# EAGLE design SBWiFi (EAGLE 8.6.1)
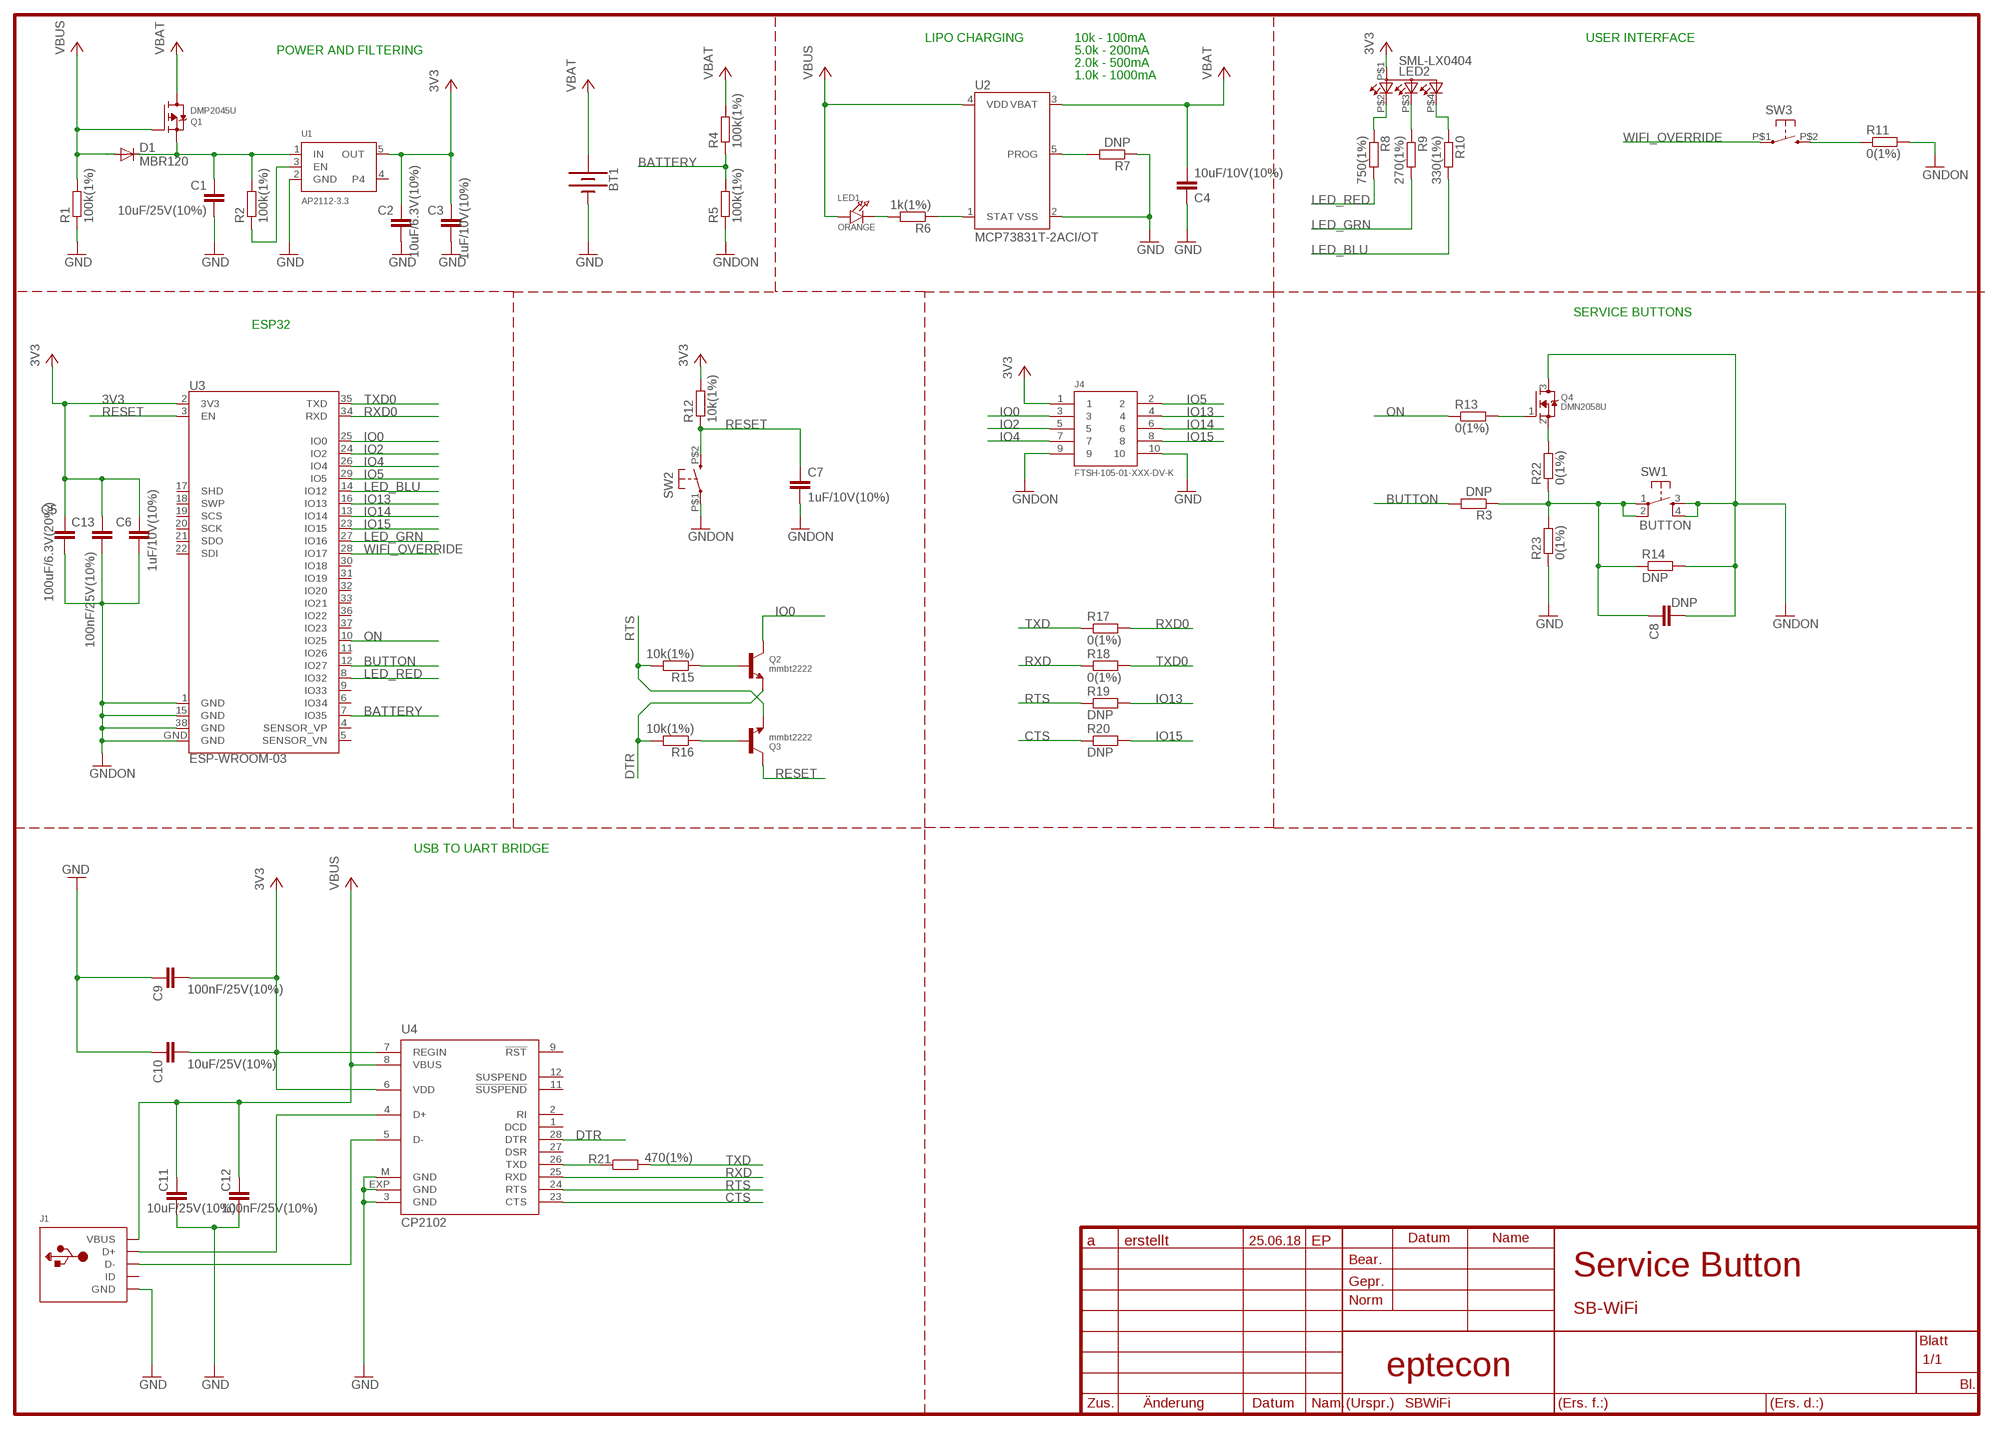
[diagram p0: schematic, sheet 1]

## Parts
BT1  BATTERY-AA  [BATTERY-AA]
C1  10uF/25V(10%)  C-EUC0603  [C0603]
C2  10uF/6.3V(10%)  C-EUC0603  [C0603]
C3  1uF/10V(10%)  C-EUC0603  [C0603]
C4  10uF/10V(10%)  C-EUC0603  [C0603]
C5  100uF/6.3V(20%)  C-EUC0805  [C0805]
C6  1uF/10V(10%)  C-EUC0603  [C0603]
C7  1uF/10V(10%)  C-EUC0603  [C0603]
C8  DNP  C-EUC0603  [C0603]
C9  100nF/25V(10%)  C-EUC0603  [C0603]
C10  10uF/25V(10%)  C-EUC0603  [C0603]
C11  10uF/25V(10%)  C-EUC0603  [C0603]
C12  100nF/25V(10%)  C-EUC0603  [C0603]
C13  100nF/25V(10%)  C-EUC0603  [C0603]
D1  MBR120  MBR0520LT  [SOD123]
J1  USBMINIBLARGE  [USB-MINIB_LARGER]
J4  FTSH-105-01-XXX-DV-K  [FTSH-105-01-XXX-DV-K]
LED1  ORANGE  LED0805_NOOUTLINE  [CHIPLED_0805_NOOUTLINE]
LED2  SML-LX0404  [LED_RGB]
Q1  DMP2045U  MOSFET-P  [SOT23-R]
Q2  mmbt2222  TRANSISTOR_NPN  [SOT23-R]
Q3  mmbt2222  TRANSISTOR_NPN  [SOT23-R]
Q4  DMN2058U  MOSFET-NREFLOW  [SOT23-R]
R1  100k(1%)  R-EU_R0603  [R0603]
R2  100k(1%)  R-EU_R0603  [R0603]
R3  DNP  R-EU_R0603  [R0603]
R4  100k(1%)  R-EU_R0603  [R0603]
R5  100k(1%)  R-EU_R0603  [R0603]
R6  1k(1%)  R-EU_R0603  [R0603]
R7  DNP  R-EU_R0603  [R0603]
R8  750(1%)  R-EU_R0603  [R0603]
R9  270(1%)  R-EU_R0603  [R0603]
R10  330(1%)  R-EU_R0603  [R0603]
R11  0(1%)  R-EU_R0603  [R0603]
R12  10k(1%)  R-EU_R0603  [R0603]
R13  0(1%)  R-EU_R0603  [R0603]
R14  DNP  R-EU_R0603  [R0603]
R15  10k(1%)  R-EU_R0603  [R0603]
R16  10k(1%)  R-EU_R0603  [R0603]
R17  0(1%)  R-EU_R0603  [R0603]
R18  0(1%)  R-EU_R0603  [R0603]
R19  DNP  R-EU_R0603  [R0603]
R20  DNP  R-EU_R0603  [R0603]
R21  470(1%)  R-EU_R0603  [R0603]
R22  0(1%)  R-EU_R0603  [R0603]
R23  0(1%)  R-EU_R0603  [R0603]
SW1  BUTTON  TACTILE-SWITCH-7914G  [7914G]
SW2  SKTDLDE010-T-SWITCH  [T-SWITCH-ALPS-2]
SW3  SKTDLDE010-T-SWITCH  [T-SWITCH-ALPS-2]
U1  AP2112-3.3  VREG_SOT23-5  [SOT23-5]
U2  MCP73831T-2ACI/OT  MCP73831  [SOT23-5]
U3  ESP-WROOM-03  [ESP-WROOM-03]
U4  CP2102  [MLP28]

## Nets
3V3: C2.1 C3.1 C5.1 C6.1 C9.2 C10.2 C13.1 J4.1 LED2.P$1(A2) R12.2 U1.5(OUT) U3.2(3V3) U4.6(VDD) U4.7(REGIN)
BATTERY: R4.1 R5.2 U3.7(IO35)
BUTTON: R3.2 U3.12(IO27)
CTS: R20.1 U4.23(CTS)
DTR: Q2.2(E) R16.2 U4.28(DTR)
GND: BT1.GND@1(-) C1.2 C2.2 C3.2 C4.1 C9.1 C10.1 C11.1 C12.1 J1.GND J4.9 J4.10 R1.1 R5.1 R7.1 R11.2 R23.1 U1.2(GND) U2.2(VSS) U4.3(GND) U4.EXP(GND) U4.M(GND) ; supply symbol labelled GNDON
GNDON: C5.2 C6.2 C7.2 C8.2 C13.2 Q4.3(D) R14.2 SW1.3 SW1.4 SW2.P$1 U3.1(GND) U3.15(GND) U3.38(GND) U3.GND
IO0: J4.3 Q2.3(C) U3.25(IO0)
IO2: J4.5 U3.24(IO2)
IO4: J4.7 U3.26(IO4)
IO5: J4.2 U3.29(IO5)
IO13: J4.4 R19.2 U3.16(IO13)
IO14: J4.6 U3.13(IO14)
IO15: J4.8 R20.2 U3.23(IO15)
LED_BLU: R10.2 U3.14(IO12)
LED_GRN: R9.2 U3.27(IO16)
LED_RED: R8.2 U3.8(IO32)
N$1: LED2.P$2(CRED) R8.1
N$2: LED2.P$3(CBLUE) R9.1
N$3: LED2.P$4(CGREEN) R10.1
N$4: C8.1 R3.1 R14.1 R22.1 R23.2 SW1.1 SW1.2
N$5: Q4.2(S) R22.2
N$6: Q4.1(G) R13.2
N$7: R2.1 U1.3(EN)
N$10: C1.1 D1.C Q1.2(S) R2.2 U1.1(IN)
N$24: Q3.1(B) R16.1
N$25: R21.1 U4.26(TXD)
N$26: Q2.1(B) R15.1
N$27: J1.D+ U4.4(D+)
N$28: J1.D- U4.5(D-)
N$31: R11.1 SW3.P$2
N$33: R6.1 U2.1(STAT)
N$34: LED1.C R6.2
N$37: R7.2 U2.5(PROG)
ON: R13.1 U3.10(IO25)
RESET: C7.1 Q3.3(C) R12.1 SW2.P$2 U3.3(EN)
RTS: Q3.2(E) R15.2 R19.1 U4.24(RTS)
RXD: R18.1 U4.25(RXD)
RXD0: R17.2 U3.34(RXD)
TXD: R17.1 R21.2
TXD0: R18.2 U3.35(TXD)
VBAT: BT1.PWR@1(+) C4.2 Q1.3(D) R4.2 U2.3(VBAT)
VBUS: C11.2 C12.2 D1.A J1.VBUS LED1.A Q1.1(G) R1.2 U2.4(VDD) U4.8(VBUS)
WIFI_OVERRIDE: SW3.P$1 U3.28(IO17)
Unconnected: J1.ID U1.4 U3.4(SENSOR_VP) U3.5(SENSOR_VN) U3.6(IO34) U3.9(IO33) U3.11(IO26) U3.17(SHD) U3.18(SWP) U3.19(SCS) U3.20(SCK) U3.21(SDO) U3.22(SDI) U3.30(IO18) U3.31(IO19) U3.32(IO20) U3.33(IO21) U3.36(IO22) U3.37(IO23) U4.1(DCD) U4.2(RI) U4.9(!RST) U4.11(!SUSPEND) U4.12(SUSPEND) U4.27(DSR)

## Notes on the sheet
- LIPO CHARGING | 10k - 100mA | USER INTERFACE
- POWER AND FILTERING | 5.0k - 200mA
- 2.0k - 500mA
- 1.0k - 1000mA
- SERVICE BUTTONS
- ESP32
- USB TO UART BRIDGE
- a | erstellt | 25.06.18 | EP
- Service Button
- SB-WiFi
- eptecon

## Library data of the parts
BT1 = SparkFun-Batteries:BATTERY: Battery - Single Cell A variety of battery chemistries, sizes, and footprints. Device List: 20MM_PTH - Coin Cell Battery Holder - 20mm (PTH) <https://www.sparkfun.com/products/783> 6.8MM_PTH - Coin Cell Battery Holder - 6.8MM(SMD) <https://www.digikey.com/product-detail/en/seiko-instruments/MS621FE-FL11E/728-1057-ND/1889208?WT.srch=1&gclid=CNOQ5a6LzdQCFZS2wAodXCkE0g> 12MM_SMD - Coin Cell Battery Holder - 12mm (SMD) <https://www.sparkfun.com/products/10592> 12MM_PTH - Coin Cell Battery Holder - 12mm (PTH) <https://www.sparkfun.com/products/7948> 20MM_SMD - 20mm Coin Cell Battery Holder (SMD) (2 legs) Used on the Big Time Watch Kit <https://www.sparkfun.com/products/11734> 20MM_SMD_4LEGS - Coin Cell Battery Holder - 20mm (SMD) <https://www.sparkfun.com/products/11892> 20MM_SMD_4LEGS_OVERPASTE - Coin Cell Battery Holder - 20mm (SMD) <https://www.sparkfun.com/products/11892> (Over-paste on the legs) 24.5MM_PTH - Coin Cell Battery Holder - 24.5mm (PTH) <https://www.sparkfun.com/products/8863> 9V - 9V Battery Holder - PC Mount Used on the SparkFun SparkPunk Sound Kit <https://www.sparkfun.com/products/11177> and SparkFun SparkPunk Sequencer Kit <https://www.sparkfun.com/products/12707> 18650 - Battery Holder - 18650 (PTH) <https://www.sparkfun.com/products/13113> AA - Battery Holder - 1xAA (PTH) <https://www.sparkfun.com/products/7949> AAA - Battery Holder - 1xAAA (PTH) <https://www.sparkfun.com/products/12718> AA_KIT - Battery Holder - 1xAA (PTH) <https://www.sparkfun.com/products/7949> Special kit package - pads only have exposed copper on one side of the board. AAA_KIT - Battery Holder - 1xAAA (PTH) <https://www.sparkfun.com/products/12718> Special kit package - pads only have exposed copper on one side of the board.; PROD_ID: BATT-08316; SF_SKU: PRT-07949
C1-C13 = rcl:C-EU: CAPACITOR, European symbol
D1 = diode:MBR0520LT: SCHOTTKY BARRIER RECTIFIER Source: http://onsemi.com .. MBR0520LT1-D.pdf
J1 = microbuilder:USB: USB Connectors USBMINIB - Surface Mount Female Mini-B USB Connector 4UConnector: 06564
J4 = FTSH-105-01-XXX-DV-K:FTSH-105-01-XXX-DV-K: 0.05"x0.05" DOUBLE ROW SMT STRIP ASSEMBLY. MANUFACTURER:SAMTEC.
LED1 = microbuilder:LED: LED 0603 - 0603 Surface Mount Package 2mA: Green LED - Low Power (3.9mcd, 2ma, 1.7Vf) - Digikey: 475-2709-2-ND Orange LED - Low Power (9.8mcd, 2ma, 1.8Vf) - Digikey: 475-1194-2-ND Red LED - Low Power (5mcd, 2ma, 1.8Vf) - Digikey: 475-1195-2-ND Yellow LED - Low Power (7mcd, 2ma, 1.8Vf) - Digikey: 475-1196-2-ND 5mA: Blue LED - Low Power (17mcd, 5ma, 2.9Vf) - Digikey: LNJ937W8CRACT-ND 0805 - 0805 Surface Mount Package 2mA: Red LED (8.8mcd, 2mA, 1.8Vf, Clear) - Low Power [Digikey: 475-2510-1-ND] Green LED (5mcd, 2mA, 1.8Vf, Clear) - Low Power [Digikey: 475-2730-1-ND] Yellow LED (11.3mcd, 2mA, 1.8Vf, Clear) - Low Power [Digikey: 475-2555-1-ND] 20mA: Red LED (104mcd, 20mA, Diffused) - LS R976 [Digikey: 475-1278-6-ND] Red LED (12mcd, 20mA, 2.0Vf, Clear) - APT2012EC [Digikey: 754-1128-1-ND] Green LED (15mcd, 20mA, 2.2Vf, Clear) - APT2012GC [Digikey: 754-1131-1-ND] Orange LED (160mcd, 20mA, 2.1Vf, Clear) - APT2012SECK [Digikey: 754-1130-1-ND] 1206 - 1206 Surface Mount Package Green LED (26mcd, 20mA, Diffused) - LG N971 [Digikey: 475-1407-6-ND] Red LED (15mcd, 20mA, Diffused) - LH N974 [Digikey: 475-1416-6-ND]
LED2 = led:SML-LX0404
Q1 = microbuilder:MOSFET-P: P-Channel Mosfet LEGEND VDS: Voltage Drain-Source ID: Drain Current RDS(ON): Drain-Source On-State Resistance VGS(TH): Gate-Source Threshold Voltage CISS: Drain-Source Input Capacitance SOT-23 Name VDS ID RDS(ON) VGS(TH) CISS Order Number IRLML5103 30V 760mA 600 mOhm -- 75pF @ 25V Digikey: IRLML5103PBFCT-ND IRLML6401 12V 4.3A 50 mOhm 950mV @ 250µA 830pF @ 10V Digikey: IRLML6401PBFTR-ND NTR0202PL 20V 400mA 800 mOhm 2.3V @ 250uA 70pF @ 5V Digikey: NTR0202PLT1GOSTR-ND NTR4101PT1G 20V 1.8A 85 mOhm 1.2V @ 250uA 675pF @ 10V Digikey: NTR4101PT1GOSCT-ND DMP2004K 20V 600mA 900 mOhm 1V @ 250uA 175pF @ 16V Digikey: DMP2004KDICT-ND PMV65XP 20V 3.9A 76 mOhm 950mV @ 1mA 725pF @ 20V Digikey: 568-2358-2-ND TO-252 Name VDS ID RDS(ON) VGS(TH) CISS Order Number AOD417 30V 25A 34 mOhm 3V @ 250µA 920pF @ 15V Digikey: 785-1106-2-ND
Q2 Q3 = microbuilder:TRANSISTOR_NPN: NPN Transistor Transistor (NPN) 500mA 45V - BC817 [Digikey: 568-1631-1-ND] Transistor (NPN) 500mA 45V - BC817,215 [Mouser: 771-BC817-T/R] SOT23-R - SOT23 footprint optimised for use with solder paste and reflow ovens. SOT23-W - SOT23 footprint optimised for hand-soldering (larger pads).
Q4 = microbuilder:MOSFET-N: N-Channel Mosfet LEGEND VDS: Voltage Drain-Source ID: Drain Current RDS(ON): Drain-Source On-State Resistance VGS(TH): Gate-Source Threshold Voltage CISS: Drain-Source Input Capacitance SOT-23 Name VDS ID RDS(ON) VGS(TH) CISS Order Number 2N7002E 60V 260mA 2.5 Ohm 2.5V @ 250uA 26.7pF @ 25V 2N7002ET1GOSTR-ND BSH103 30V 850mA 400 mOhm 400mV @ 1mA 83pF @ 24V BSH103,235-ND BSS138 60V 320mA 1.6 Ohm 1.5V @ 250uA 50pF @ 10V Mouser: 771-BSS138PW115 DMN2075U-7 20V 4.2A 38 mOhm 1V @ 250 uA 594.3pF @ 10V DMN2075U-7DICT-ND * BSS138 good choice for I2C level-shifting
R1-R23 = rcl:R-EU_: RESISTOR, European symbol
SW1 = GeekAmmo:TACTILE-SWITCH: Tactile Switch 4 Pins, SPST NO
SW2 SW3 = GeekAmmo:SKTDLDE010-T-SWITCH
U1 = microbuilder:VREG_SOT23-5: SOT23-5 Fixed Voltage Regulators To better organise some of the SOT23-5 fixed voltage regulators in this library, this new part was created. Part Current Out V Out V In V Dropout Digikey Part No. ADP121 150mA 3.3V 3.4-5.5V 0.09V @ 150mA ADP121-AUJZ33R7CT-ND ADP121 150mA 3.0V 3.1-5.5V 0.09V @ 150mA ADP121-AUJZ30R7CT-ND ADP122 300mA 3.3V 3.4-5.5V 0.085V @ 300mA ADP122AUJZ-3.3-R7CT-ND ADP1712 300mA 3.3V 3.5-5.5V 0.17V @ 300mA ADP1712AUJZ-3.3-R7TR-ND AP7311 (Low Cost) 150mA 3.3V 3.5-6V 0.15V @ 150mA AP7311-33WG-7DICT-ND LD39015M18R 150mA 1.8V 1.9V-5.5V 0.08V @ 100mA 497-6977-1-ND MCP1824T-3302E/OT 300mA 3.3V 3.5V-6V 0.2V @ 300mA MCP1824T-3302E/OTCT-ND MIC5205-2.5YM5 TR 150mA 2.5V 2.7-16V 0.165V @ 150mA 576-1257-2-ND MIC5205-3.0YM5 TR 150mA 3.0V 3.2V-16V 0.165V @ 150mA 576-1258-2-ND MIC5205-3.3YM5 TR 150mA 3.3V 3.5V-16V 0.165V @ 150mA 576-1259-2-ND TPS780330220 150mA 3.3V+2.2V 3.6-5.5V 250mV Max 296-23332-1-ND TDA3663/N1,135 100mA 3.3V 3.5-45V 0.18V @ 50mA 568-5343-1-ND
U2 = GeekAmmo:MCP73831: MCP73831 Miniature Single-Cell, Fully Integrated Li-Ion, Li-Polymer Charge Management Controllers The MCP73831/2 devices are highly advanced linear charge management controllers for use in spacelimited, cost-sensitive applications. http://ww1.microchip.com/downloads/en/DeviceDoc/20001984F.pdf
U3 = esp32-thing-temp:ESP-WROOM-03
U4 = silabs:CP210*: Single-Chip USB to UART Bridge Source: www.silabs.com .. CP2101.pdf / cp2102.pdf; MF: FARNELL; MPN: CP2102-GM; OC_FARNELL: 9282130; OC_NEWARK: 30K5635

## Board
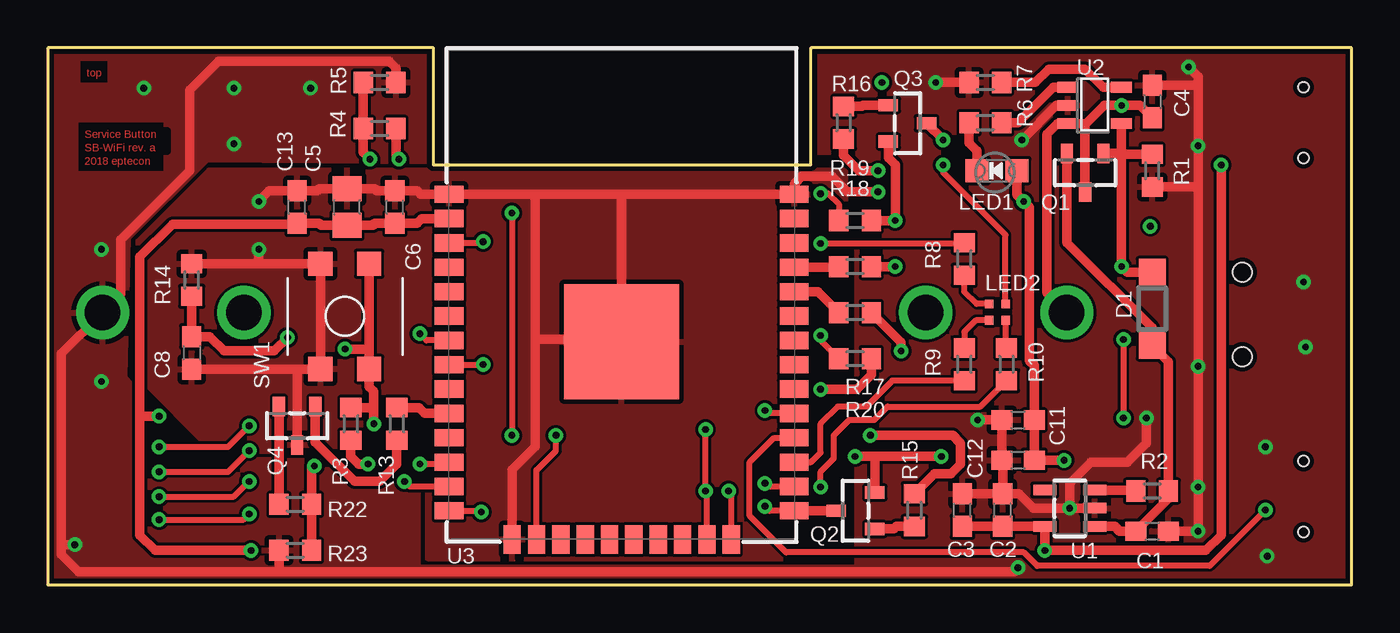
[diagram p1: board, top side]
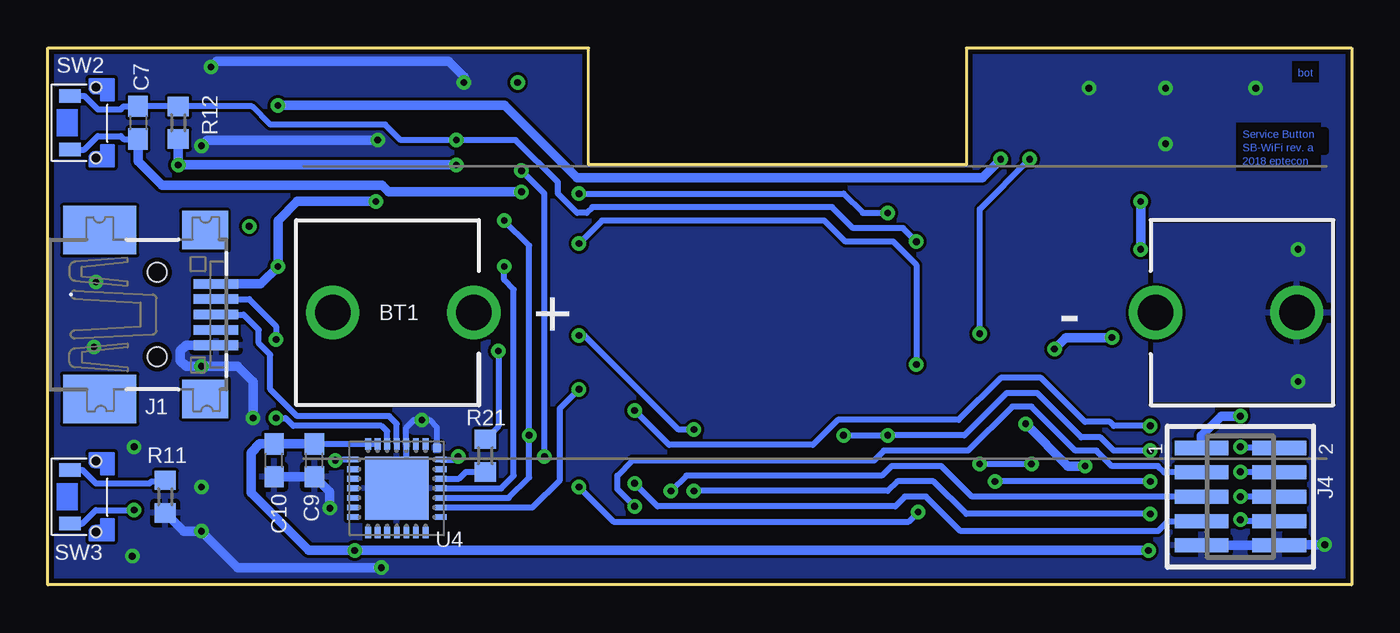
[diagram p2: board, bottom side, seen from below]

Size 68 x 28 mm. Coordinates in mm from the lower left corner, seen from the top.
Outline: 0,0 68,0 68,28 39.8,28 39.8,21.9 20.1,21.9 20.1,28 0,28 0,0
Copper layers (1*16): Top 0.035mm / dielectric 1.5mm / Bottom 0.035mm
Design rules "default *": minimum track width 10mil, minimum drill 10mil, track to track 6mil, track to pad 6mil, pad to pad 6mil, via to via 6mil, smd to smd 6mil, copper to edge 10mil, drill to drill 8mil, minimum pad ring 10mil, minimum via ring 8mil, stop-mask expansion 4mil, vias tented up to drill 0mil, thermal gap 10mil
tRestrict: area 1.7,26.2 to 3.1,27.3; area 1.6,21.6 to 6,24.1
bRestrict: area 1.7,26.2 to 3.1,27.3; area 1.6,21.6 to 6,24.1

### Footprints (pad centres in the part's own frame; a part is rotated, then mirrored left to right if it is on the bottom)
BATTERY-AA = drill 1.854: GND@1 25.146,0; GND@2 17.78,0; PWR@1 -25.146,0; PWR@2 -17.78,0
C0603 = smd 1.1 x 1: 1 -0.85,0; 2 0.85,0
C0805 = smd 1.3 x 1.5: 1 -0.95,0; 2 0.95,0
SOD123 = smd 1.4 x 1.4: A 1.9,0; C -1.9,0
USB-MINIB_LARGER = smd 0.5 x 2.308: D+ 0,4.064; D- -0.8,4.064; GND 1.6,4.064; ID 0.8,4.064; VBUS -1.6,4.064 | smd 2.54 x 3.81: GND1 -4.4,-2; GND4 4.4,-2 | smd 2 x 2.4: GND2 -4.4,3.5; GND3 4.4,3.5 | hole 1: -2.2,1; 2.2,1
FTSH-105-01-XXX-DV-K = smd 0.737 x 2.794: 1 -2.54,-2.032; 2 -2.54,2.032; 3 -1.27,-2.032; 4 -1.27,2.032; 5 0,-2.032; 6 0,2.032; 7 1.27,-2.032; 8 1.27,2.032; 9 2.54,-2.032; 10 2.54,2.032
CHIPLED_0805_NOOUTLINE = smd 1.2 x 1.2: A 0,-1.05; C 0,1.05
LED_RGB = smd 0.45 x 0.45: P$1 -0.45,-0.45; P$2 0.4,-0.45; P$3 0.4,0.4; P$4 -0.45,0.4
SOT23-R = smd 0.635 x 1.016: 1 -0.95,-1; 2 0.95,-1; 3 0,1
R0603 = smd 1 x 1.1: 1 -0.85,0; 2 0.85,0
7914G = smd 1.27 x 1.27: 1 -1.254,-2.746; 2 -1.254,2.74; 3 1.286,-2.746; 4 1.286,2.74
T-SWITCH-ALPS-2 = smd 0.7 x 1.1: P$1 -1.4,1.35; P$2 1.4,1.35 | hole 0.55: -1.85,0; 1.85,0
SOT23-5 = smd 0.55 x 1.2: 1 -0.95,-1.3; 2 0,-1.3; 3 0.95,-1.3; 4 0.95,1.3; 5 -0.95,1.3
SOT23-5' = smd 0.55 x 1.1: 1 -0.95,-1.3; 2 0,-1.3; 3 0.95,-1.3; 4 0.95,1.5; 5 -0.95,1.5
ESP-WROOM-03 = smd 0.9 x 1.5: 1 7.7,9; 2 6.43,9; 3 5.16,9; 4 3.89,9; 5 2.62,9; 6 1.35,9; 7 0.08,9; 8 -1.19,9; 9 -2.46,9; 10 -3.73,9; 11 -5,9; 12 -6.27,9; 13 -7.54,9; 14 -8.81,9; 25 -8.81,-9; 26 -7.54,-9; 27 -6.27,-9; 28 -5,-9; 29 -3.73,-9; 30 -2.46,-9; 31 -1.19,-9; 32 0.08,-9; 33 1.35,-9; 34 2.62,-9; 35 3.89,-9; 36 5.16,-9; 37 6.43,-9; 38 7.7,-9 | smd 1.5 x 0.9: 15 -10.3,5.715; 16 -10.3,4.445; 17 -10.3,3.175; 18 -10.3,1.905; 19 -10.3,0.635; 20 -10.3,-0.635; 21 -10.3,-1.905; 22 -10.3,-3.175; 23 -10.3,-4.445; 24 -10.3,-5.715 | smd 6 x 6: GND 0,0
MLP28 = smd 0.6 x 0.3: 1 -2.3,1.5; 2 -2.3,1; 3 -2.3,0.5; 4 -2.3,0; 5 -2.3,-0.5; 6 -2.3,-1; 7 -2.3,-1.5; 15 2.3,-1.5; 16 2.3,-1; 17 2.3,-0.5; 18 2.3,0; 19 2.3,0.5; 20 2.3,1; 21 2.3,1.5 | smd 0.3 x 0.6: 8 -1.5,-2.3; 9 -1,-2.3; 10 -0.5,-2.3; 11 0,-2.3; 12 0.5,-2.3; 13 1,-2.3; 14 1.5,-2.3; 22 1.5,2.3; 23 1,2.3; 24 0.5,2.3; 25 0,2.3; 26 -0.5,2.3; 27 -1,2.3; 28 -1.5,2.3 | smd 3.3 x 3.3: EXP 0,0 | smd 0.435 x 0.435: M -2.103,2.103

### Placement (x,y rotation side)
BT1  28,14.2 0 bottom
C1  57.6,2.8 0 top
C2  49.8,3.9 90 top
C3  47.7,3.9 90 top
C4  57.6,25.2 270 top
C5  15.6,19.7 90 top
C6  18.1,19.7 90 top
C7  63.3,24.1 270 bottom
C8  7.5,12.1 270 top
C9  54.1,6.5 90 bottom
C10  56.2,6.5 90 bottom
C11  50.6,8.6 0 top
C12  50.6,6.5 0 top
C13  13,19.7 90 top
D1  57.6,14.4 90 top
J1  63.3,14.1 270 bottom
J4  5.8,4.6 270 bottom
LED1  49.5,21.6 90 top
LED2  49.5,14.2 180 top
Q1  54.1,21.5 180 top
Q2  42.13,3.87 90 top
Q3  44.84,24.07 270 top
Q4  13,8.3 180 top
R1  57.6,21.6 90 top
R2  57.6,4.9 0 top
R3  15.8,8.4 270 top
R4  17.3,23.8 0 top
R5  17.3,26.2 180 top
R6  48.9,24.1 180 top
R7  48.9,26.2 0 top
R8  47.8,17 90 top
R9  47.8,11.5 270 top
R10  50,11.5 270 top
R11  61.88,4.6 270 bottom
R12  61.2,24.1 270 bottom
R13  18.2,8.4 270 top
R14  7.5,15.9 90 top
R15  45.2,3.9 90 top
R16  41.5,24.1 270 top
R17  42.1,14.2 180 top
R18  42.1,16.6 180 top
R19  42.1,19 180 top
R20  42.1,11.8 180 top
R21  45.19,6.74 90 bottom
R22  12.9,4.2 180 top
R23  12.9,1.8 0 top
SW1  15.5,14 180 top
SW2  65.5,24.1 90 bottom
SW3  65.5,4.6 90 bottom
U1  53.3,4 90 top
U2  MCP73831T-2ACI/OT  [SOT23-5']  54.5,25 270 top
U3  29.93,12.67 90 top
U4  49.8,5.04 270 bottom

### Tracks (layer width: path | path; a pad name or v marks a point on that pad's centre or on a via)
3V3  (via drill 0.35)
  Top 0.3: LED2.P$1 49.95,18.25 46.7,21.5 v46.7,21.9
  Top 0.5: U3.2 19.5,19.1 19.25,18.85 C6.1 17.05,18.85 16.95,18.75 C5.1 14.25,18.75 14.15,18.85 C13.1 12.95,18.8 6.5,18.8 4.8,17.1 4.8,8.8 | v52,1.8 U1.5 C2.1 C3.1 | v52,1.8 | v10.6,1.8 5.6,1.8 4.8,2.6 4.8,8.8 | v52,1.8 60.4,1.8 61.2,2.6 v61.2,21.9 | v5.8,8.8 4.8,8.8
  Bottom 0.3: U4.6 U4.7 54.09,7.34 C9.2
  Bottom 0.5: v46.7,21.9 v61.2,21.9 R12.2 | v10.6,1.8 v52,1.8 54.4,1.8 57.4,4.8 57.4,6.9 56.95,7.35 C10.2 C9.2 | J4.1 7.83,7.77 6.8,8.8 v5.8,8.8
BATTERY  (via drill 0.35)
  Top 0.3: U3.7 19.75,12.75 v19.4,13.1
  Top 0.5: R5.2 R4.1 16.45,22.55 v16.8,22.2
  Bottom 0.3: v16.8,22.2 19.4,19.6 v19.4,13.1
BUTTON  (via drill 0.35)
  Top 0.3: 20.83,6.3 v19.4,6.3
  Top 0.5: U3.12 20.83,6.3 | v16.7,6.3 16.2,6.3 15.8,6.7 R3.2
  Bottom 0.3: v16.7,6.3 v19.4,6.3
CTS  (via drill 0.35)
  Top 0.5: R20.1 42.95,10.95 42.2,10.2 v40.3,10.2
  Bottom 0.3: U4.23 42.73,4.04 41.3,5.47 41.3,9.2 v40.3,10.2
DTR  (via drill 0.35)
  Top 0.5: v46.6,6.7 43.1,6.7 | 43.1,6.7 v42.1,6.7 | Q2.2 43.13,6.67 43.1,6.7 | R16.2 41.5,22.4 42.3,21.6 v43.3,21.6
  Bottom 0.3: U4.28 46.76,6.54 v46.6,6.7 | v43.3,21.6 42.1,20.4 v42.1,6.7
GND  (via drill 0.35)
  Top 0.5: U2.2 52.6,25 v50.8,23.2 | 0.7,2.1 0.7,1.6 1.6,0.7 12.1,0.7 | 0.7,2.1 0.7,12.05 BT1.GND@1 3.8,15.15 3.8,18 7.4,21.6 7.4,25.8 8.9,27.3 17.8,27.3 18.15,26.95 R5.1 | v1.4,2.1 0.7,2.1 | 60,20.8 v60,11.4 v60,5.1 v60,2.8 C1.2 | 60,20.8 v60,22.9 60,26.1 | R1.1 59.95,20.75 60,20.8 | 60,26.1 60,26.5 v59.5,27 | C4.1 59.95,26.05 60,26.1 | v50.6,0.9 50.4,0.7 12.1,0.7 | R23.1 12.05,0.75 12.1,0.7 | C3.2 C2.2 | C2.2 49.8,6.45 C12.1 C11.1 v48.5,8.6 | C2.2 50.65,4.75 51.4,4 v53.3,4 | v53.3,4 U1.2 | v53.3,4 53.3,5.3 54.4,6.4 56.3,6.4 57.3,7.4 v57.3,8.7 | R7.1 v46.3,26.2
  Bottom 0.3: U4.EXP 49.3,5.54 U4.3 49.3,8.2 48.9,8.6 v48.5,8.6 48.1,8.6 47.7,8.2 U4.M
  Bottom 0.5: J4.9 J4.10 3.73,2.1 v1.4,2.1 | v59.5,27 59.2,27.3 47.1,27.3 46.3,26.5 v46.3,26.2 | v53.3,4 53.3,4.85 C9.1 C10.1 | v50.8,23.2 59.7,23.2 v60,22.9 | R11.2 60.92,2.8 v60,2.8 58.1,0.9 v50.6,0.9 | J1.GND 60.8,12.5 61.1,12.2 61.1,11.7 60.8,11.4 v60,11.4 58.1,11.4 57.3,10.6 v57.3,8.7
  other vias: 2.8,10.6 2.8,17.5 5,25.9 9.7,25.9 13.7,25.9 9.7,23 63.6,1.5 63.5,7.2 65.5,15.8 65.6,12.4
  pour Top: 19.8,22.1 19.8,27.7 0.3,27.7 0.3,0.3 67.7,0.3 67.7,27.7 40.1,27.7 40.1,22.6 42.2,22.6 42.2,0.9 19.3,0.9 19.3,6.5 8,6.5 4,10.8 4.2,18.1 8.3,22.2
  pour Bottom: 0.3,27.7 19.8,27.7 19.8,21.7 19.8,21.6 40.1,21.6 40.1,27.7 67.7,27.7 67.7,0.3 0.3,0.3
GNDON  (via drill 0.35)
  Top 0.5: 13.05,7.35 Q4.3 13,11.25 | 24.2,20.37 U3.1 19.43,20.37 19.25,20.55 C6.2 17.15,20.55 17.05,20.65 C5.2 14.15,20.65 14.05,20.55 C13.2 11.55,20.55 v11,20 | 24.2,20.37 25.4,20.37 | 25.4,20.37 30,20.37 | 30,20.37 U3.38 38.93,20.93 39.3,21.3 40.9,21.3 41.7,20.5 v43.3,20.5 | 30,20.37 29.93,20.3 U3.GND 29.8,12.8 25.4,12.8 | 24.21,20.36 24.2,20.37 | U3.15 24.21,6.01 25.4,7.2 25.4,12.8 | 25.4,12.8 25.4,20.37 | 10.9,16.75 11,16.85 v11,17.5 | 10.9,16.75 SW1.3 SW1.4 13,11.25 | 10.9,16.75 R14.2 | C8.2 13,11.25
  Bottom 0.3: SW2.P$1 66.1,22.7 65.4,23.4 64.2,23.4 64.05,23.25 C7.2
  Bottom 0.5: v43.3,20.5 50.22,20.5 50.56,20.83 62.03,20.83 63.3,22.1 C7.2 | v11,17.5 v11,20
  pour Top: 20.1,21.6 8.4,21.6 4.7,17.9 4.7,10.9 8.6,7 19.8,7 19.8,1.4 41.6,1.4 41.6,21.6
IO0  (via drill 0.35)
  Top 0.3: U3.25 37.64,3.86 v37.4,4.1
  Top 0.5: Q2.3 U3.25
  Bottom 0.3: J4.3 9.77,5.87 10.1,6.2 12.5,6.2 13.3,7 14.4,7 16.7,9.3 17.7,9.3 20,7 24.4,7 24.9,6.5 37.5,6.5 38.3,5.7 38.3,5 v37.4,4.1
IO2  (via drill 0.35)
  Top 0.3: U3.24 35.64,4.76 v35.5,4.9
  Bottom 0.3: J4.5 19.8,4.6 21.4,6.2 24,6.2 24.5,5.7 34.7,5.7 v35.5,4.9
IO4  (via drill 0.35)
  Top 0.3: U3.26 37.57,5.13 v37.4,5.3
  Bottom 0.3: J4.7 7.86,3.3 9.6,3.3 10.1,2.8 20.4,2.8 22.2,4.6 23.3,4.6 23.8,4.1 36.2,4.1 v37.4,5.3
IO5  (via drill 0.35)
  Top 0.3: U3.29 37.56,8.94 v37.4,9.1 | v5.8,7.2 9.4,7.2 v10.5,8.3
  Bottom 0.3: J4.2 5.74,7.14 v5.8,7.2 | v10.5,8.3 12.4,8.3 12.6,8.5 13.9,8.5 16.2,10.8 18.3,10.8 20.5,8.6 26.8,8.6 28.1,7.3 35.6,7.3 v37.4,9.1
IO13  (via drill 0.35)
  Top 0.3: v40.3,20.4 40.7,20.4 41.25,19.85 R19.2 | v10.5,7 9.4,5.9 v5.8,5.9 | v24.2,19.4 v24.2,7.8 | U3.16 25.48,5.98 26.5,7 v26.5,7.8
  Bottom 0.3: J4.4 5.77,5.87 v5.8,5.9 | v40.3,20.4 26.5,20.4 25.5,19.4 v24.2,19.4 | v10.5,7 12.4,7 13.1,7.7 14.1,7.7 16.4,10 18,10 20.2,7.8 v24.2,7.8 v26.5,7.8
IO14  (via drill 0.35)
  Top 0.3: v5.8,4.6 9.7,4.6 v10.5,5.4 | U3.13 18.87,5.13 v18.6,5.4
  Bottom 0.3: J4.6 v5.8,4.6 | v10.5,5.4 v18.6,5.4
IO15  (via drill 0.35)
  Top 0.3: R20.2 40.3,12.75 v40.3,13 | v5.8,3.4 10.2,3.4 v10.5,3.7 | U3.23 34.37,4.83 v34.3,4.9 v34.3,8.1
  Bottom 0.3: J4.8 5.73,3.33 v5.8,3.4 | v10.5,3.7 20.1,3.7 21.8,5.4 23.7,5.4 24.2,4.9 v34.3,4.9 | v40.3,13 40,13 35.1,8.1 v34.3,8.1
LED_BLU  (via drill 0.35)
  Top 0.3: v40.3,5.1 40.3,5.9 41,6.6 41,7.8 41.8,8.6 43.1,8.6 43.8,9.3 48.65,9.3 R10.2 | U3.14 22.54,3.86 v22.6,3.8
  Bottom 0.3: v40.3,5.1 38.5,3.3 23.1,3.3 v22.6,3.8
LED_GRN
  Top 0.3: U3.27 39.8,6.4 40.3,6.9 40.3,8.4 41.2,9.3 42.7,9.3 44.05,10.65 R9.2
LED_RED  (via drill 0.35)
  Top 0.3: U3.8 22.68,11.48 v22.7,11.5 | R8.2 47.75,17.8 v40.3,17.8
  Bottom 0.3: v22.7,11.5 22.7,16.7 23.9,17.9 26.4,17.9 27.5,19 39.1,19 v40.3,17.8
N$1
  Top 0.3: LED2.P$2 48.45,14.65 47.8,15.3 R8.1
N$2
  Top 0.3: LED2.P$3 48.4,13.8 47.8,13.2 R9.1
N$3
  Top 0.3: LED2.P$4 49.95,12.4 R10.1
N$4  (via drill 0.35)
  Top 0.5: R23.2 R22.1 | R22.1 13.8,4.25 | R22.1 13.75,6.05 v13.9,6.2 | v17,8.4 17,9.3 | R3.1 16.95,9.25 17,9.3 | v12.5,12.9 11.8,12.2 9.2,12.2 8.45,12.95 C8.1 R14.1 | 16.75,12.3 SW1.2 16.75,10.35 17,10.1 17,9.3 | 16.75,12.3 SW1.1 | v15.5,12.3 16.75,12.3
  Bottom 0.5: v17,8.4 14.8,6.2 v13.9,6.2 | v15.5,12.3 14.9,12.9 v12.5,12.9
N$5
  Top 0.5: R22.2 Q4.2
N$6
  Top 0.5: R13.2 18.2,6.3 17.3,5.4 16,5.4 13.95,7.45 Q4.1
N$7
  Top 0.5: U1.3 56.7,4.95 R2.1
N$10
  Top 0.5: Q1.2 53.15,17.85 57.6,13.4 D1.C 58.45,11.65 R2.2 58.45,4.5 C1.1 55.9,2.8 55.65,3.05 U1.1
N$24
  Top 0.3: 43.82,25.01 Q3.1
  Top 0.5: Q3.1 42.52,25.02 42.45,24.95 R16.1
N$25
  Bottom 0.3: U4.26 46.56,5.54 46.2,5.9 R21.1
N$26
  Top 0.5: Q2.1 44.12,2.92 44.25,3.05 R15.1
N$27
  Bottom 0.3: U4.4 49.8,8.4 50.2,8.8 55,8.8 56.4,10.2 56.4,12 57,12.6 57,13.3 57.8,14.1 J1.D+
N$28  (via drill 0.35)
  Top 0.3: v56.1,12.8 v56.1,8.7
  Bottom 0.3: v56.1,8.7 55.61,8.7 55.21,8.3 50.6,8.3 50.3,8 U4.5 | J1.D- 57.5,14.9 56.1,13.5 v56.1,12.8
N$30  (via drill 0.35)
  other vias: 43.5,26.2
N$31
  Bottom 0.3: R11.1 61.93,5.4 62.6,5.4 62.7,5.3 65.5,5.3 66.2,6 SW3.P$2
N$33
  Top 0.5: U2.1 52.45,25.95 50.6,24.1 R6.1
N$34
  Top 0.5: LED1.C 48.45,22.65 48.05,23.05 R6.2
N$35  (via drill 0.35)
  other vias: 57.5,18.7
N$37
  Top 0.5: U2.5 55.05,25.95 54.1,26.9 52.2,26.9 51.5,26.2 R7.2
ON
  Top 0.5: U3.10 19.66,8.94 19.35,9.25 R13.1
RESET  (via drill 0.35)
  Top 0.3: v22.7,17.9 22.63,17.83 U3.3
  Top 0.5: 46.07,24.07 Q3.3 v46.7,23.21 v46.7,23.2
  Bottom 0.3: R12.1 61.25,24.9 | v22.7,17.9 23.4,18.6 26,18.6 27.1,19.7 39.6,19.7 39.9,19.4 40.4,19.4 41.4,20.4 41.4,21 43.6,23.2 v46.7,23.2 49.6,23.2 50.4,24 56.4,24 57.35,24.95 R12.1 | SW2.P$2 66.1,25.5 65.4,24.8 64.2,24.8 64.05,24.95 C7.1 R12.1
RTS  (via drill 0.35)
  Top 0.5: R19.1 v44.2,19 44.2,21.9 43.84,22.26 Q3.2 | R15.2 46.25,5.8 47.1,5.8 47.6,6.3 47.6,7.4 47.2,7.8 v42.9,7.8
  Bottom 0.3: U4.24 43.96,4.54 42.9,5.6 v42.9,7.8 42.9,17.7 v44.2,19
RXD  (via drill 0.35)
  Top 0.5: R18.1 v44.2,16.6
  Bottom 0.3: U4.25 44.36,5.04 43.7,5.7 43.7,15.4 44.2,15.9 v44.2,16.6
RXD0
  Top 0.5: U3.34 40.16,15.29 R17.2
TXD  (via drill 0.35)
  Top 0.5: 42.95,14.05 R17.1 44.5,12.65 v44.5,12.2
  Bottom 0.3: R21.2 44.5,8.28 v44.5,12.2
TXD0
  Top 0.5: R18.2 41.21,16.56 U3.35
VBAT  (via drill 0.35)
  Top 0.5: C4.2 56.95,25 v56,25 55.1,25 54.15,24.05 | 54.15,24.05 U2.3 52.65,24.05 52.1,23.5 52.1,15.25 BT1.PWR@1 | Q1.3 54.1,24 54.15,24.05 | R4.2 18.15,22.35 v18.3,22.2
  Bottom 0.5: v56,25 44.17,25 40.4,21.23 19.27,21.23 v18.3,22.2
VBUS  (via drill 0.35)
  Top 0.5: D1.A 56.3,16.3 v56,16.6 56,22.5 | U2.4 56,22.5 | Q1.1 56,22.5 | LED1.A 50.55,20.35 v50.9,20 51.2,19.7 51.2,11.7 51.45,11.45 C11.2 C12.2 v53,6.5 | R1.2 56.05,22.45 56,22.5
  Bottom 0.3: U4.8 52.96,6.54 v53,6.5
  Bottom 0.5: v50.9,20 55,20 56,19 v56,16.6 56.9,15.7 J1.VBUS
WIFI_OVERRIDE  (via drill 0.35)
  Top 0.3: v63.5,3.9 60.6,1 51.6,1 50.9,1.7 38.5,1.7 36.6,3.6 36.6,6.4 37.87,7.67 U3.28
  Bottom 0.3: SW3.P$1 66.2,3.2 65.5,3.9 v63.5,3.9

### Text on the board
Top: top | SB-WiFi rev. a | Service Button | 2018 eptecon
Bottom: bot | SB-WiFi rev. a | Service Button | 2018 eptecon